# Altium schematic sheet 12V to 12V Buck Boost.SchDoc
size A
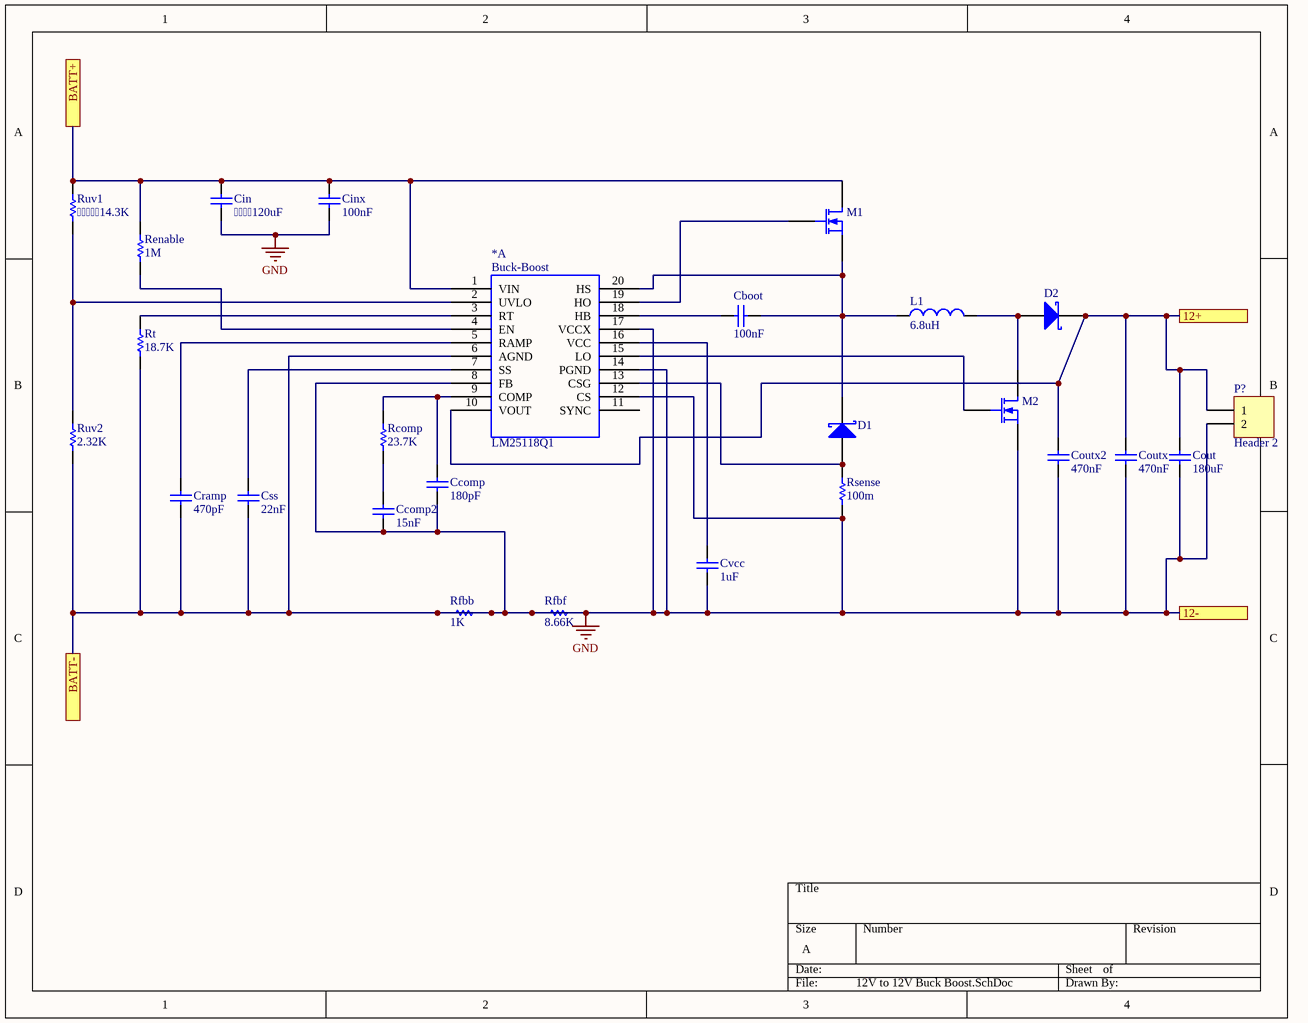
[diagram p0: 12V to 12V Buck Boost.SchDoc]

## Parts
*  LM25118Q1  (part A of 3)
Cboot  value 100nF  (hidden comment: Capacitor)
Ccomp  value 180pF  (hidden comment: Capacitor)
Ccomp2  value 15nF  (hidden comment: Capacitor)
Cin  value 120uF  (hidden comment: Capacitor)
Cinx  value 100nF  (hidden comment: Capacitor)
Cout  value 180uF  (hidden comment: Capacitor)
Coutx  value 470nF  (hidden comment: Capacitor)
Coutx2  value 470nF  (hidden comment: Capacitor)
Cramp  value 470pF  (hidden comment: Capacitor)
Css  value 22nF  (hidden comment: Capacitor)
Cvcc  value 1uF  (hidden comment: Capacitor)
D1  Shottky Diode  (value not drawn)
D2  Shottky Diode  (value not drawn)
L1  value 6.8uH  (hidden comment: Inductor)
M1  N-chanel Power MOSFET VDMOS Model  (value not drawn)
M2  N-chanel Power MOSFET VDMOS Model  (value not drawn)
P?  Header 2  [HDR1X2]
Rcomp  value 23.7K  (hidden comment: Resistor)
Renable  value 1M  (hidden comment: Resistor)
Rfbb  value 1K  (hidden comment: Resistor)
Rfbf  value 8.66K  (hidden comment: Resistor)
Rsense  value 100m  (hidden comment: Resistor)
Rt  value 18.7K  (hidden comment: Resistor)
Ruv1  value 14.3K  (hidden comment: Resistor)
Ruv2  value 2.32K  (hidden comment: Resistor)

## Ports
12+, 12-, BATT+, BATT-

## Nets
GND: *.6(AGND) *.8(FB) *.12(CS) *.14(PGND) *.17(VCCX) Ccomp.1 Ccomp2.1 Cin.1 Cinx.1 Cout.1 Coutx.1 Coutx2.1 Cramp.1 Css.1 Cvcc.1 M2.3(S) P?.2 Rfbb.1 Rfbb.2 Rfbf.1 Rfbf.2 Rsense.1 Rt.1 Ruv2.1 ; port BATT-, port 12-
12+: *.10(VOUT) Cout.2 Coutx.2 Coutx2.2 D2.2(K) P?.1 ; port 12+
BATT+: *.1(VIN) Cin.2 Cinx.2 M1.1(D) Renable.2 Ruv1.2 ; port BATT+
Net*_2: *.2(UVLO) Ruv1.1 Ruv2.2
Net*_3: *.3(RT) Rt.2
Net*_4: *.4(EN) Renable.1
Net*_5: *.5(RAMP) Cramp.2
Net*_7: *.7(SS) Css.2
Net*_9: *.9(COMP) Ccomp.2 Rcomp.2
Net*_13: *.13(CSG) D1.1(A) Rsense.2
Net*_15: *.15(LO) M2.2(G)
Net*_16: *.16(VCC) Cvcc.2
Net*_18: *.18(HB) Cboot.2
Net*_19: *.19(HO) M1.2(G)
Net*_20: *.20(HS) Cboot.1 D1.2(K) L1.1 M1.3(S)
NetCcomp2_2: Ccomp2.2 Rcomp.1
NetD2_1: D2.1(A) L1.2 M2.1(D)

Not connected (* = marked no-connect by the designer): * 11(SYNC)

## Notes on the sheet
- (in symbol LM25118Q1, part A) Buck-Boost

## Library data of the parts
Cboot Ccomp Ccomp2 Cin Cinx Cout Coutx Coutx2 Cramp Css Cvcc = Capacitor: SimulationGenericComponent: True
D1 D2 = Shottky Diode: AF: 1; BV: 0; BV_MAX: 1e99; EG: 1.11; FC: 0.5; IBV: 0.001; IS: 1e-14; MJSW: 0.33; NTUN: 30; TNOM: 27; XTI: 3; SimulationGenericComponent: True; CJO: 0; CJP: 0; CTA: 0; CTP: 0; FCS: 0.5; FV_MAX: 1e99; IKF: 0; IKR: 0; ISR: 1e-14; JSW: 0; JTUN: 0; JTUNSW: 0; KEG: 1; KF: 0; LEVEL: 1; N: 1; NBV: 1; NR: 1; NS: 1; PHP: 1; RS: 0; TCV: 0; TLEV: 0; TLEVC: 0; TM1: 0; TM2: 0; TPB: 0; TPHP: 0; TRS: 0; TRS2: 0; TT: 0; TTT1: 0; TTT2: 0; VJ: 1; XTITUN: 3
L1 = Inductor: SimulationGenericComponent: True
M1 M2 = MOSFET N-ch VDMOS: XTI: 0; A: 1; BV: 1e30; EG: 1.11; FC: 0.5; IBV: 1e-10; IS: 1e-14; PHI: 0.6; TNOM: 27; VJ: 0.8; SimulationGenericComponent: True; CGDMAX: 0; CGDMIN: 0; CGS: 0; CJO: 0; KP: 1; KSUBTHRES: 0; LAMBDA: 0; M: 0.5; MTRIODE: 1; N: 1; NBV: 1; NCHAN: 1; RB: 0; RD: 0; RDS: 1e30; RG: 0; RQ: 0; RS: 0; SUBSHIFT: 0; SUBSLOPE: 0; THETA: 0; TT: 0; VQ: 0; VTO: 0
P? = Header 2: Header, 2-Pin; LatestRevisionDate: 17-Jul-2002; LatestRevisionNote: Re-released for DXP Platform.; Publisher: Altium Limited
Rcomp Renable Rfbb Rfbf Rsense Rt Ruv1 Ruv2 = Resistor: TC1: 0; SimulationGenericComponent: True; TC2: 0